# Altium schematic sheet Modbus.SchDoc
size A4; SheetNumber: 4; SheetTotal: 6
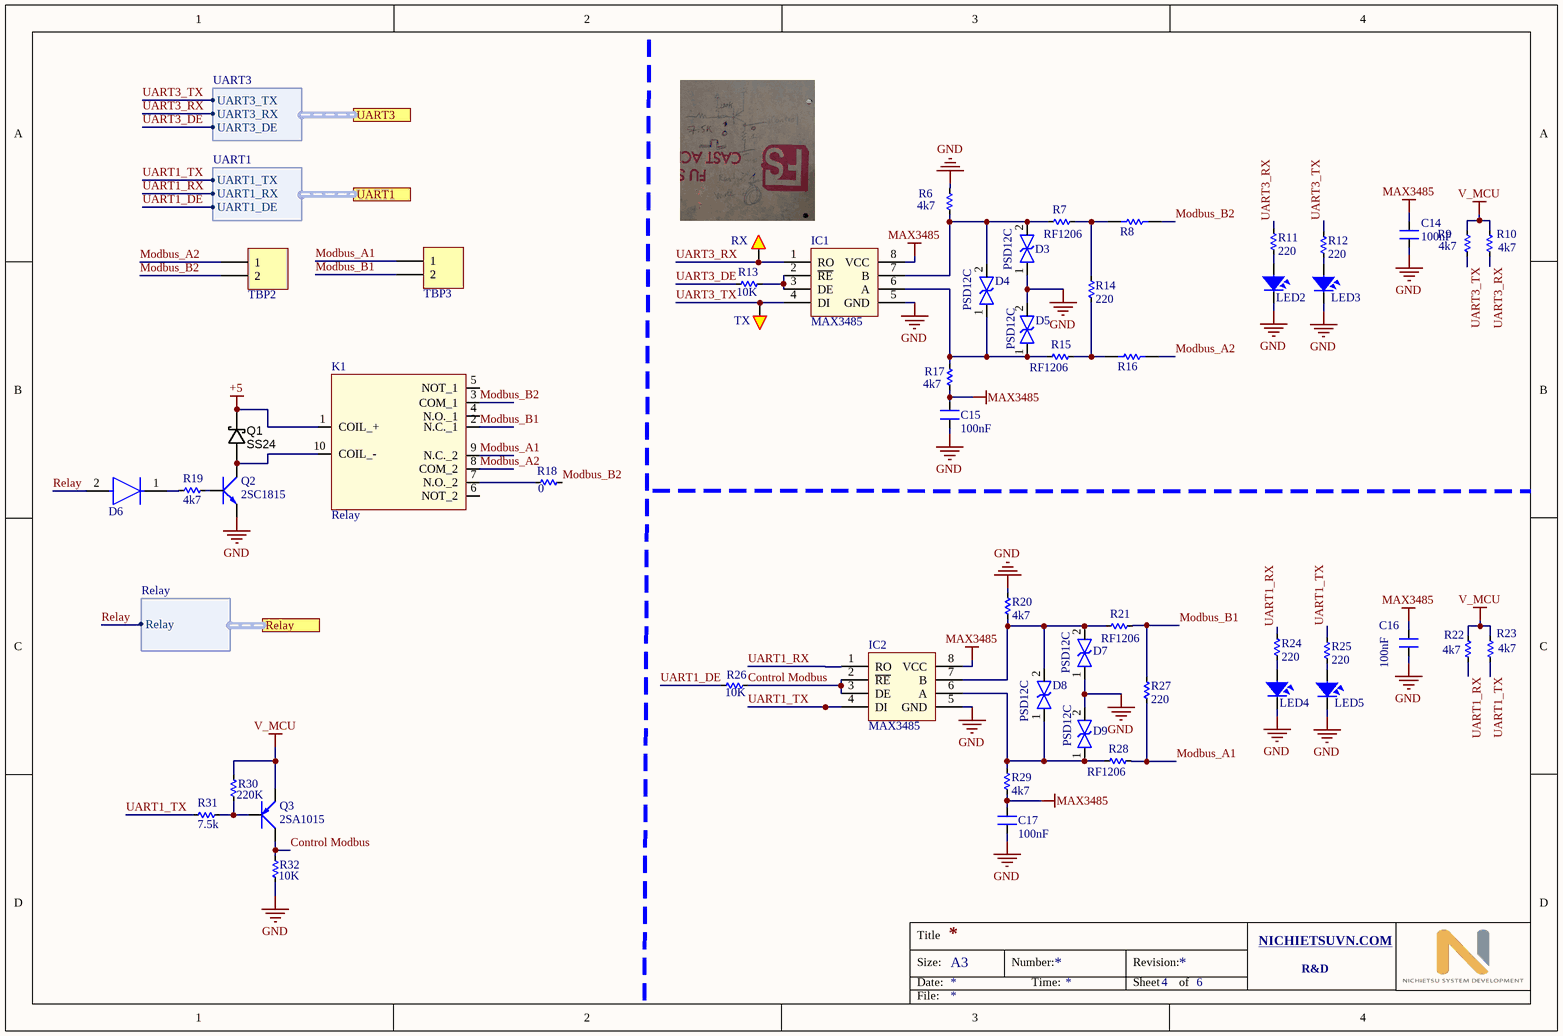
[diagram p0: Modbus.SchDoc]

## Parts
B1  RX  [SMD_1.5]
B2  TX  [SMD_1.5]
C14  100nF  [CN-SMD-0603]
C15  100nF  [CN-SMD-0603]
C16  100nF  [CN-SMD-0603]
C17  100nF  [CN-SMD-0603]
D3  PSD12C  [PSD12C]
D4  PSD12C  [PSD12C]
D5  PSD12C  [PSD12C]
D6  1N4148W-HE3-08  [1N4148]  (value not drawn)
D7  PSD12C  [PSD12C]
D8  PSD12C  [PSD12C]
D9  PSD12C  [PSD12C]
IC1  MAX3485  [SO8]
IC2  MAX3485  [SO8]
K1  Relay  [Relay EA2]
LED2  LED  [LED-0805-Blue]  (value not drawn)
LED3  LED  [LED-0805-Blue]  (value not drawn)
LED4  LED  [LED-0805-Blue]  (value not drawn)
LED5  LED  [LED-0805-Blue]  (value not drawn)
Q1  SS24  [DO-214AC]
Q2  2SC1815  [SOT23-321]
Q3  2SA1015  [SOT23-321]
R6  4k7  [RES-SMD-0603]
R7  RF1206  [RES-SMD-1206]
R8  0R/R0603  [R0603]  (value not drawn)
R9  4k7  [RES-SMD-0603]
R10  4k7  [RES-SMD-0603]
R11  220  [RES-SMD-0603]
R12  220  [RES-SMD-0603]
R13  10K  [RES-SMD-0603]
R14  220  [RES-SMD-0603]
R15  RF1206  [RES-SMD-1206]
R16  0R/R0603  [R0603]  (value not drawn)
R17  4k7  [RES-SMD-0603]
R18  0  [RES-SMD-0603]
R19  4k7  [RES-SMD-0603]
R20  4k7  [RES-SMD-0603]
R21  RF1206  [RES-SMD-1206]
R22  4k7  [RES-SMD-0603]
R23  4k7  [RES-SMD-0603]
R24  220  [RES-SMD-0603]
R25  220  [RES-SMD-0603]
R26  10K  [RES-SMD-0603]
R27  220  [RES-SMD-0603]
R28  RF1206  [RES-SMD-1206]
R29  4k7  [RES-SMD-0603]
R30  220K  [RES-SMD-0603]
R31  7.5k  [RES-SMD-0603]
R32  10K  [RES-SMD-0603]
TBP2  WE-Terminal Blocks Plugable Type 691322310002  [Terminal_Blocks_Pluggable_Socket__Right_Angle__3.81_mm_Pitch__2_Position]  (value not drawn)
TBP3  WE-Terminal Blocks Plugable Type 691322310002  [Terminal_Blocks_Pluggable_Socket__Right_Angle__3.81_mm_Pitch__2_Position]  (value not drawn)

## Ports
Relay (harness Relay), UART1 (harness UART1), UART3 (harness UART3)

## Harnesses
UART1: UART1_TX, UART1_RX, UART1_DE
UART3: UART3_TX, UART3_RX, UART3_DE
Relay: Relay

## Nets
+5: K1.1(COIL_+) Q1.C
GND: C14.1 C15.2 C16.1 C17.2 D3.1 D5.2 D7.1 D9.2 IC1.5(GND) IC2.5(GND) LED2.2 LED3.2 LED4.2 LED5.2 Q2.1(E) R6.1 R20.1 R32.1
MAX3485: C14.2 C15.1 C16.2 C17.1 IC1.8(VCC) IC2.8(VCC) R17.1 R29.1
V_MCU: Q3.1(E) R9.1 R10.1 R22.1 R23.1 R30.2
Control Modbus: IC2.2(~{RE}) IC2.3(DE) Q3.2(C) R26.2 R32.2
Modbus_A1: K1.9(N.C._2) R27.2 R28.1 TBP3.1
Modbus_A2: K1.8(COM_2) R16.2 TBP2.1
Modbus_B1: K1.2(N.C._1) R21.1 R27.1 TBP3.2
Modbus_B2: K1.3(COM_1) R8.2 R18.2 TBP2.2
Relay: D6.2(A) ; port Relay.Relay
UART1_DE: R26.1 ; port UART1.UART1_DE
UART1_RX: IC2.1(RO) R22.2 R24.1 ; port UART1.UART1_RX
UART1_TX: IC2.4(DI) R23.2 R25.1 R31.1 ; port UART1.UART1_TX
UART3_DE: R13.1 ; port UART3.UART3_DE
UART3_RX: B1.1 IC1.1(RO) R10.2 R11.1 ; port UART3.UART3_RX
UART3_TX: B2.1 IC1.4(DI) R9.2 R12.1 ; port UART3.UART3_TX
NetD3_2: D3.2 D4.2 IC1.7(B) R6.2 R7.2
NetD4_1: D4.1 D5.1 IC1.6(A) R15.2 R17.2
NetD6_1: D6.1(C) R19.2
NetD7_2: D7.2 D8.2 IC2.7(B) R20.2 R21.2
NetD8_1: D8.1 D9.1 IC2.6(A) R28.2 R29.2
NetIC1_2: IC1.2(~{RE}) IC1.3(DE) R13.2
NetK1_7: K1.7(N.O._2) R18.1
NetK1_10: K1.10(COIL_-) Q1.A Q2.2(C)
NetLED2_1: LED2.1 R11.2
NetLED3_1: LED3.1 R12.2
NetLED4_1: LED4.1 R24.2
NetLED5_1: LED5.1 R25.2
NetQ2_3: Q2.3(B) R19.1
NetQ3_3: Q3.3(B) R30.1 R31.2
NetR7_1: R7.1 R8.1 R14.1
NetR14_2: R14.2 R15.1 R16.1

Not connected (* = marked no-connect by the designer): K1 4(N.O._1) 5(NOT_1) 6(NOT_2)

## Notes on the sheet
- Title
- Size:
- Date:
- A3
- Number:
- Time:
- Revision:
- Sheet
- of
- NICHIETSUVN.COM <http://NICHIETSUVN.COM>
- R&D
- File:

## Library data of the parts
B1 B2 = Test: WR-PHD 2.54 mm Angled Socket Header; Manufacturer: W¨¹rth Elektronik eiSos GmbH; partNo: 613002143121; ComponentLink1 Description: Manufacturer; ComponentLink2 Description: Datasheet; NoPins: 02; Created Date: 29 March 2013; ComponentLink1URL: http://www.we-online.com; ComponentLink2URL: http://katalog.we-online.de/em/datasheet/6130xx143121.pdf; Created by: Karrer Zheng
C14-C17 = CN: Value: 33pF
D3-D5 D7-D9 = PSD12C: diode tvs
IC1 IC2 = MAX485: RS232 - RS485 (Same sn75176)
K1 = EA2-5NU: Relay or Contactor; Manufacturer_Name: Kemet; Datasheet Link: https://api.kemet.com/component-edge/download/datasheet/EA2-5NU.pdf; Height: 5.4mm; Manufacturer_Part_Number: EA2-5NU
LED2-LED5 = LED SMD: Value: LED 3 - 5 ly 2 Colour
Q1 = DIODE_SS24: Diode Schottky 40V 2A Surface Mount DO-214AC (SMA); Manufacturer 1: Comchip Technology; Manufacturer Part Number 1: SS24-HF; Speed: Fast Recovery =< 500ns, > 200mA (Io); Ratings: 40V; 2A; Pcs 2: 1; Parameter 1Voltage - Forward (Vf) (Max) @ If: 550mV @ 2A; Package / Case: DO-214AC, SMA; Diode Type: Schottky; Mounting Type: Surface Mount; Supplier 1: Digi-Key; Supplier Part Number 1: 641-SS24-HFDKR-ND; Supplier 2: https://www.thegioiic.com; Supplier Part Number 2: https://www.thegioiic.com/products/ss24-sma; Price 2: 800
Q2 = 2SC1815: NPN 600mW, ECB; Value: C1815
Q3 = 2SA1015: PNP 600mW, ECB; Value: A1015
R6 R7 R9-R15 R17-R32 = Res-SMD: Resistor; Manufacturer: Generic Components; Class: Passive; Published: 08/06/2000; Publisher: Altium Hobart Technology Centre
R8 R16 = RES_0R_R0603: RES SMD 0.0OHM JUMPER 1/10W 0603; Manufacturer: Yageo; Manufacturer Part Number: RC0603JR-070RL; Resistance (Ohms): 0.0; Power (Watts): 0.1W, 1/10W; RoHS: RoHS Compliant; Category: Resistors; Packaging: Tape & Reel (TR); Tolerance: Jumper; Composition: Thick Film; Features: Moisture Resistant; Temperature Coefficient: -; Operating Temperature: -55°C ~ 155°C; Package / Case: 0603 (1608 Metric); Supplier Device Package: 0603; Size / Dimension: 0.063" L x 0.031" W (1.60mm x 0.80mm); Height: 0.022" (0.55mm); Number of Terminations: 2; ComponentLink1URL: http://www.yageo.com/documents/recent/PYu-RC_Group_51_RoHS_L_04.pdf; ComponentLink1Description: http://www.yageo.com/documents/recent/PYu-RC_Group_51_RoHS_L_04.pdf; Supplier 1: Digi-Key; Supplier Part Number 1: 311-0.0GRCT-ND
TBP2 TBP3 = Terminal_Blocks_Pluggable_Socket__Right_Angle__3.81_mm_Pitch__2_Position: WR-TBL Terminal block - serie 322 - 3.81 mm; Manufacturer 1: W¨¹rth Elektronik eiSos GmbH; ComponentLink1 Description: Manufacturer; ComponentLink2 Description: Datasheet; NoPins: 02; Pcs 2: 1; ComponentLink1URL: http://www.we-online.com; ComponentLink2URL: http://katalog.we-online.de/em/datasheet/6913223100xx.pdf; Supplier 1: Digi-Key; Supplier Part Number 1: *; Supplier 2: https://www.thegioiic.com; Manufacturer Part Number 1: 691322310002; Supplier Part Number 2: https://www.thegioiic.com/products/kf-3-81-2-r-terminal-block-plug-in-han-pcb-2-chan-cong-3-81mm; Price 2: 2000